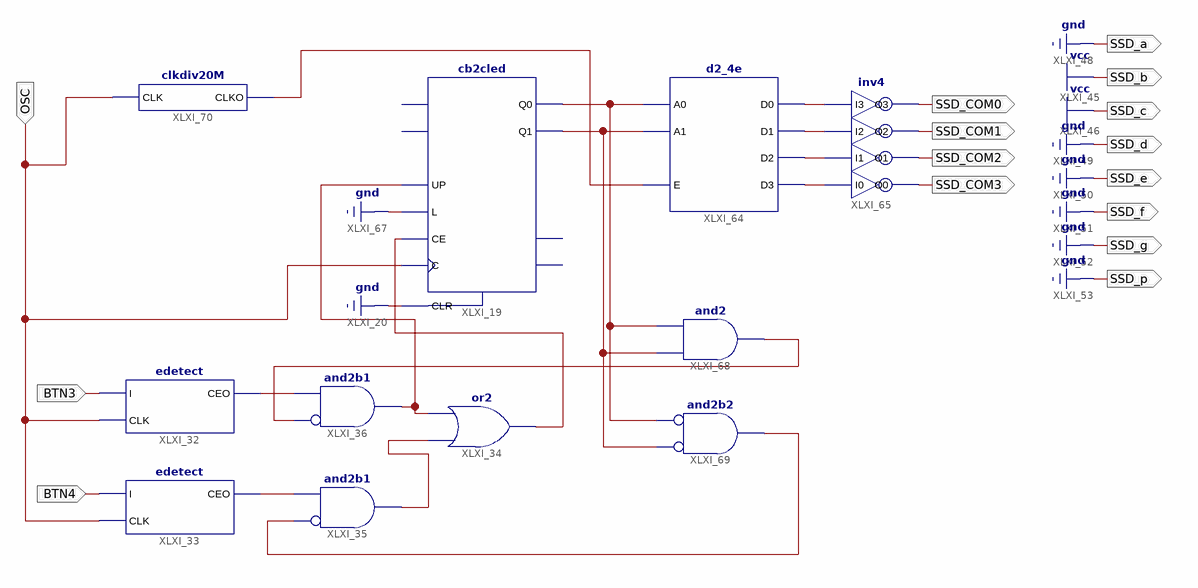
[diagram p0: schematic sheet 1]
// Xilinx ISE schematic main.sch (spartan6) as structural Verilog: 11 symbols, 15 ports
module main (
  input  OSC,
  input  BTN3,
  input  BTN4,
  output SSD_b,
  output SSD_c,
  output SSD_a,
  output SSD_d,
  output SSD_e,
  output SSD_f,
  output SSD_g,
  output SSD_p,
  output SSD_COM0,
  output SSD_COM1,
  output SSD_COM2,
  output SSD_COM3
);

  wire XLXN_34, XLXN_35, XLXN_39, XLXN_41, XLXN_42, XLXN_43, XLXN_46, XLXN_47, XLXN_48, XLXN_74, XLXN_75,
       XLXN_76, XLXN_77, XLXN_80;

  cb2cled XLXI_19 (
    .C(OSC), .CE(XLXN_35), .CLR(1'b0), .L(1'b0), .UP(XLXN_48), .Q0(XLXN_41), .Q1(XLXN_42));  // open: D0, D1, CEO, TC
  edetect XLXI_32 (.CEO(XLXN_34), .CLK(OSC), .I(BTN3));
  edetect XLXI_33 (.CEO(XLXN_39), .CLK(OSC), .I(BTN4));
  or XLXI_34 (XLXN_35, XLXN_47, XLXN_48);
  and XLXI_35 (XLXN_47, ~XLXN_46, XLXN_39);  // and2b1
  and XLXI_36 (XLXN_48, ~XLXN_43, XLXN_34);  // and2b1
  d2_4e XLXI_64 (.A0(XLXN_41), .A1(XLXN_42), .E(XLXN_80), .D0(XLXN_74), .D1(XLXN_75), .D2(XLXN_76), .D3(XLXN_77));
  inv4 XLXI_65 (
    .I0(XLXN_77), .I1(XLXN_76), .I2(XLXN_75), .I3(XLXN_74), .O0(SSD_COM3), .O1(SSD_COM2), .O2(SSD_COM1),
    .O3(SSD_COM0));
  and XLXI_68 (XLXN_43, XLXN_42, XLXN_41);
  and XLXI_69 (XLXN_46, ~XLXN_42, ~XLXN_41);  // and2b2
  clkdiv20M XLXI_70 (.CLK(OSC), .CLKO(XLXN_80));

  assign SSD_a = 1'b0;
  assign SSD_b = 1'b1;
  assign SSD_c = 1'b1;
  assign SSD_d = 1'b0;
  assign SSD_e = 1'b0;
  assign SSD_f = 1'b0;
  assign SSD_g = 1'b0;
  assign SSD_p = 1'b0;
endmodule
